# EAGLE design Chessbot_v6 (EAGLE 9.6.2)
AUTHOR: Hudson, Dunn, Ruiz; BOARD_NAME: ChessBotBoard; DOC_NUM: 1; PROJECT_NAME: Chess Bot; REVISION: 6
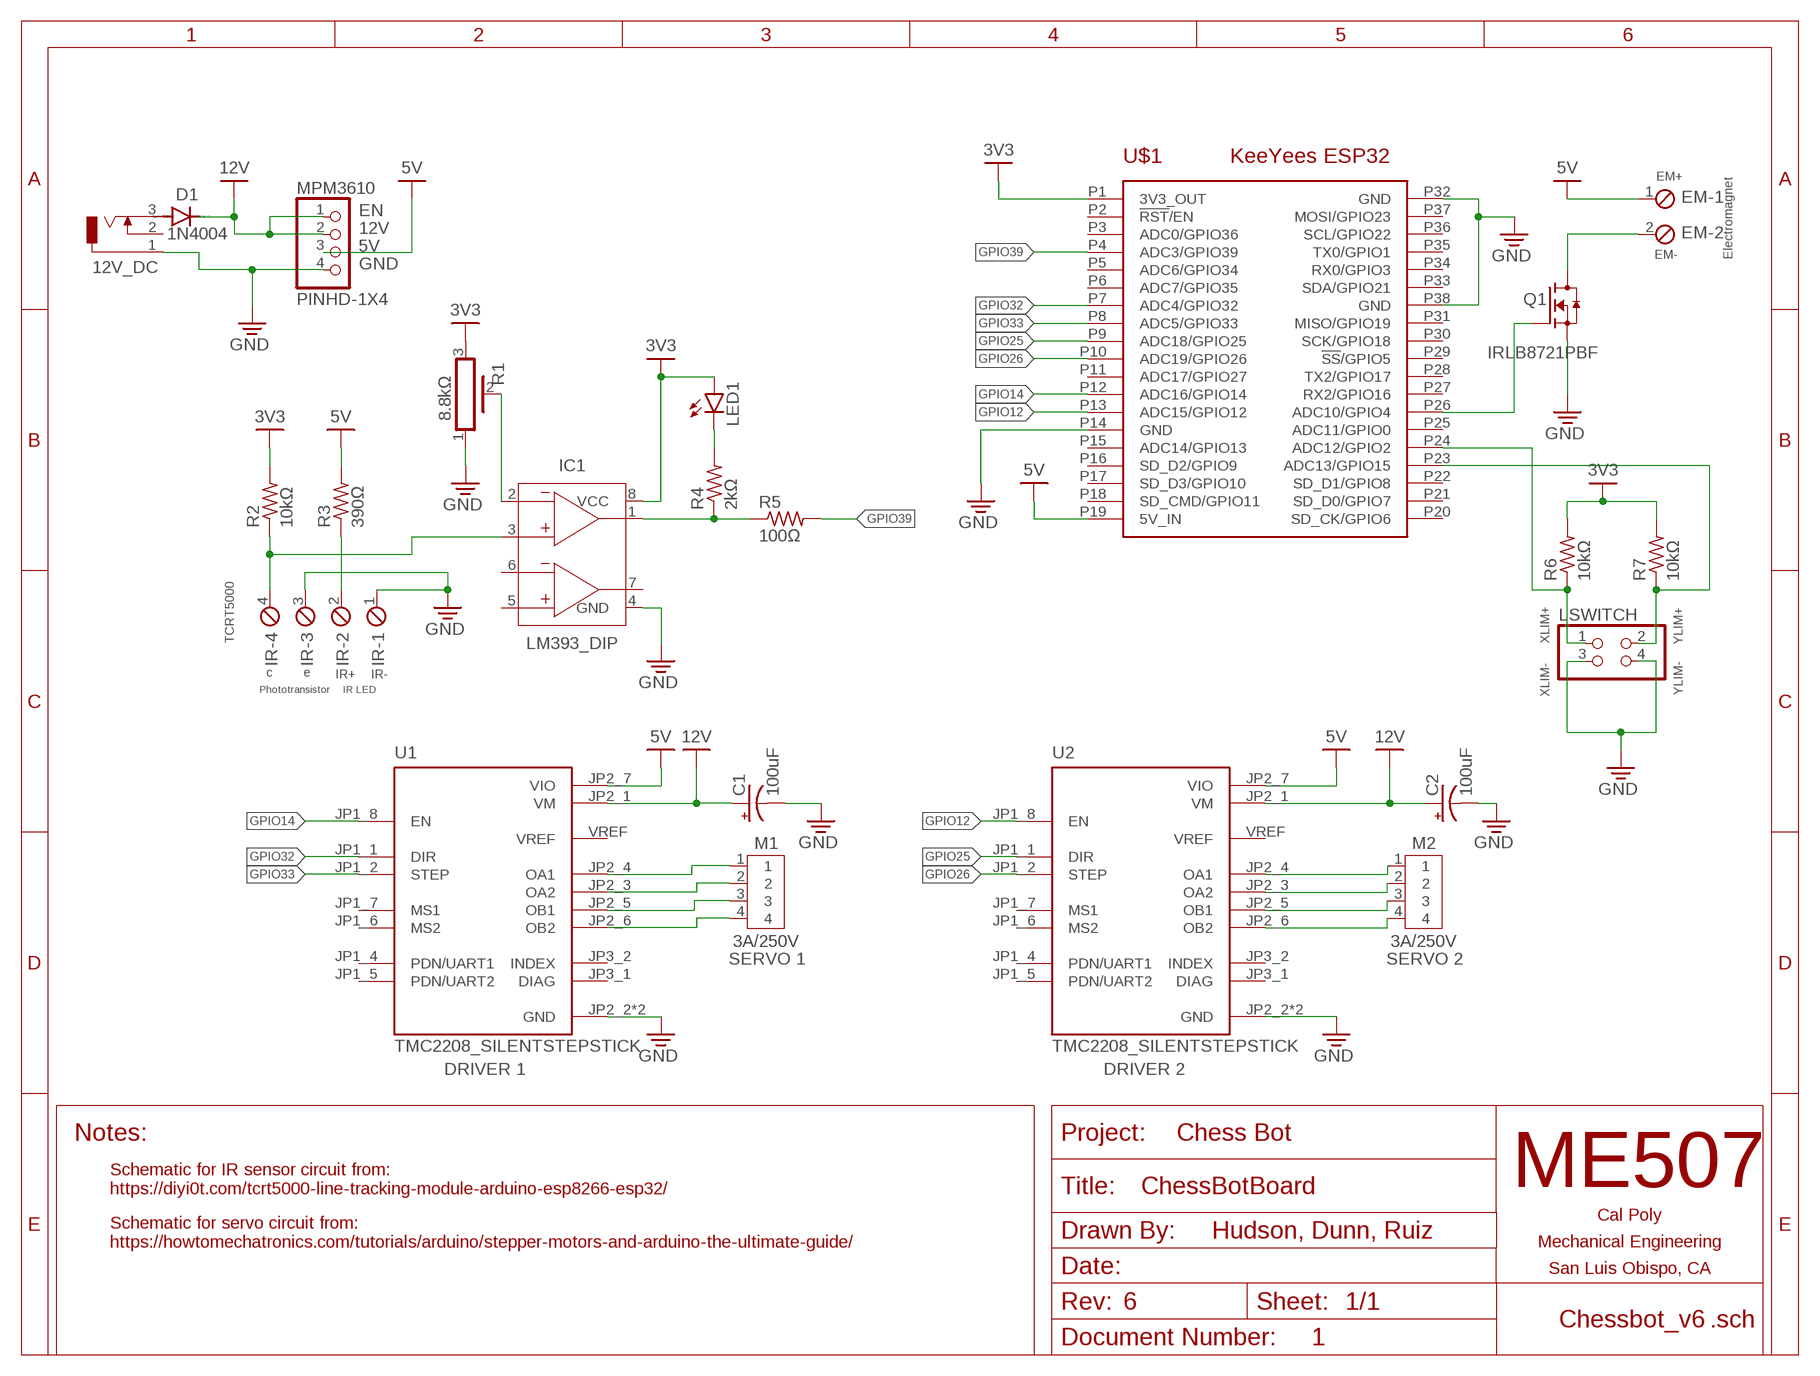
[diagram p0: schematic, sheet 1]

## Parts
12V_DC  DCJ0303  [DCJ0303]
C1  100uF  CPOL-USE2.5-6  [E2,5-6]
C2  100uF  CPOL-USE2.5-6  [E2,5-6]
D1  1N4004  [DO41-10]
EM  SCREWTERM_2P_254  [2POL254]
IC1  LM393_DIP  [DIP826W53P254L959H508Q8B]
IR  SCREWTERM_4P_254  [4POL254]
LED1  LEDSMT1206  [1206]
LSWITCH  PINHD-2X2  [2X02]
M1  3A/250V  B4B-XH-A  [B4B-XH-A]
M2  3A/250V  B4B-XH-A  [B4B-XH-A]
MPM3610  PINHD-1X4  [1X04]
Q1  IRLB8721PBF  [TO254P1067X483X2057-3]
R1  8.8kΩ  PV36Z  [PV36Z]
R2  10kΩ  R-US_R0805  [R0805]
R3  390Ω  R-US_R0805  [R0805]
R4  2kΩ  R-US_R0805  [R0805]
R5  100Ω  R-US_R0805  [R0805]
R6  10kΩ  R-US_R0805  [R0805]
R7  10kΩ  R-US_R0805  [R0805]
U1  TMC2208_SILENTSTEPSTICK  [MODULE_TMC2208_SILENTSTEPSTICK]
U2  TMC2208_SILENTSTEPSTICK  [MODULE_TMC2208_SILENTSTEPSTICK]
U$1  KEEYEES_ESP32EXT  [KEEYEES_ESP32_EXTENDED]

## Nets
3V3: IC1.8(VCC) LED1.A R1.3 R2.2 R6.2 R7.2 U$1.P1(3V3_OUT)
5V: EM.1 MPM3610.3 R3.2 U1.JP2_7(VIO) U2.JP2_7(VIO) U$1.P19(5V_IN)
12V: C1.+ C2.+ D1.C MPM3610.1 MPM3610.2 U1.JP2_1(VM) U2.JP2_1(VM)
GND: 12V_DC.1 C1.- C2.- IC1.4(GND) IR.1 IR.3 LSWITCH.3 LSWITCH.4 MPM3610.4 Q1.3(S) R1.1 U1.JP2_2(GND) U1.JP2_8(GND) U2.JP2_2(GND) U2.JP2_8(GND) U$1.P14(GND) U$1.P32(GND) U$1.P38(GND)
GPIO12: U2.JP1_8(EN) U$1.P13(ADC15/GPIO12)
GPIO14: U1.JP1_8(EN) U$1.P12(ADC16/GPIO14)
GPIO25: U2.JP1_1(DIR) U$1.P9(ADC18/GPIO25)
GPIO26: U2.JP1_2(STEP) U$1.P10(ADC19/GPIO26)
GPIO32: U1.JP1_1(DIR) U$1.P7(ADC4/GPIO32)
GPIO33: U1.JP1_2(STEP) U$1.P8(ADC5/GPIO33)
GPIO39: R5.2 U$1.P4(ADC3/GPIO39)
N$1: M2.1 U2.JP2_4(OA1)
N$2: IC1.2(-IN1) R1.2
N$3: M2.2 U2.JP2_3(OA2)
N$4: IR.2 R3.1
N$5: M2.3 U2.JP2_5(OB1)
N$6: IC1.3(+IN1) IR.4 R2.1
N$7: M2.4 U2.JP2_6(OB2)
N$8: M1.1 U1.JP2_4(OA1)
N$9: EM.2 Q1.2(D)
N$10: M1.2 U1.JP2_3(OA2)
N$11: M1.3 U1.JP2_5(OB1)
N$12: M1.4 U1.JP2_6(OB2)
N$13: IC1.1(OUT1) R4.1 R5.1
N$14: LED1.C R4.2
N$15: 12V_DC.3 D1.A
N$17: Q1.1(G) U$1.P26(ADC10/GPIO4)
N$18: LSWITCH.1 R6.1 U$1.P24(ADC12/GPIO2)
N$22: LSWITCH.2 R7.1 U$1.P23(ADC13/GPIO15)
Unconnected: 12V_DC.2 IC1.5(+IN2) IC1.6(-IN2) IC1.7(OUT2) U1.JP1_4(PDN/UART1) U1.JP1_5(PDN/UART2) U1.JP1_6(MS2) U1.JP1_7(MS1) U1.JP3_1(DIAG) U1.JP3_2(INDEX) U1.VREF U2.JP1_4(PDN/UART1) U2.JP1_5(PDN/UART2) U2.JP1_6(MS2) U2.JP1_7(MS1) U2.JP3_1(DIAG) U2.JP3_2(INDEX) U2.VREF U$1.P2(!RST!/EN) U$1.P3(ADC0/GPIO36) U$1.P5(ADC6/GPIO34) U$1.P6(ADC7/GPIO35) U$1.P11(ADC17/GPIO27) U$1.P15(ADC14/GPIO13) U$1.P16(SD_D2/GPIO9) U$1.P17(SD_D3/GPIO10) U$1.P18(SD_CMD/GPIO11) U$1.P20(SD_CK/GPIO6) U$1.P21(SD_D0/GPIO7) U$1.P22(SD_D1/GPIO8) U$1.P25(ADC11/GPIO0) U$1.P27(RX2/GPIO16) U$1.P28(TX2/GPIO17) U$1.P29(!SS!/GPIO5) U$1.P30(SCK/GPIO18) U$1.P31(MISO/GPIO19) U$1.P33(SDA/GPIO21) U$1.P34(RX0/GPIO3) U$1.P35(TX0/GPIO1) U$1.P36(SCL/GPIO22) U$1.P37(MOSI/GPIO23)

## Notes on the sheet
- EM+
- EN
- 12V
- 5V
- EM- | Electromagnet
- GND
- YLIM+
- TCRT5000 | XLIM+
- c | e | IR+ | IR-
- Phototransistor | IR LED | YLIM-
- XLIM-
- SERVO 1 | SERVO 2
- DRIVER 1 | DRIVER 2
- Schematic for IR sensor circuit from:
  https://diyi0t.com/tcrt5000-line-tracking-module-arduino-esp8266-esp32/
- Schematic for servo circuit from:
  https://howtomechatronics.com/tutorials/arduino/stepper-motors-and-arduino-the-ultimate-guide/

## Library data of the parts
12V_DC = con-jack:DCJ0303: DC POWER JACK Source: DCJ0303.pdf; OC_FARNELL: unknown; OC_NEWARK: unknown
C1 C2 = rcl:CPOL-US: POLARIZED CAPACITOR, American symbol; SPICEPREFIX: C
D1 = diode:1N4004: DIODE general purpose rectifier, 1 A
EM = ME507:SCREWTERM_2P: Screw Terminal Block This part is designed for a screw terminal connector. The 2.54mm (0.100 inch) foorprint can also be used for male or female pin headers such as those on most development boards. One can also solder wires directly into the holes, though this makes modifications or repairs to the system more inconvenient. Larger versions can carry more current.
IC1 = IC_Linear:LM393: Dual Comparators Reference Datasheet <https://www.ti.com/lit/ds/symlink/lm393-n.pdf?ts=1637561071595&ref_url=https%253A%252F%252Fwww.google.com%252F>; CATEGORY: IC_Linear; DESCRIPTION: Differential Dual Comparator; MANUFACTURER: Generic; MPN: Generic; SERIES: LM393; SUB-CATEGORY: Comparator; TYPE: Dual
IR = ME507:SCREWTERM_4P: Screw Terminal Block This part is designed for a screw terminal connector. The 2.54mm (0.100 inch) foorprint can also be used for male or female pin headers such as those on most development boards. One can also solder wires directly into the holes, though this makes modifications or repairs to the system more inconvenient. Larger versions can carry more current.
LED1 = led:LED: LED OSRAM: - CHIPLED LG R971, LG N971, LY N971, LG Q971, LY Q971, LO R971, LY R971 LH N974, LH R974 LS Q976, LO Q976, LY Q976 LO Q996 - Hyper CHIPLED LW Q18S LB Q993, LB Q99A, LB R99A - SideLED LS A670, LO A670, LY A670, LG A670, LP A670 LB A673, LV A673, LT A673, LW A673 LH A674 LY A675 LS A676, LA A676, LO A676, LY A676, LW A676 LS A679, LY A679, LG A679 - Hyper Micro SIDELED® LS Y876, LA Y876, LO Y876, LY Y876 LT Y87S - SmartLED LW L88C, LW L88S LB L89C, LB L89S, LG L890 LS L89K, LO L89K, LY L89K LS L896, LA L896, LO L896, LY L896 - TOPLED LS T670, LO T670, LY T670, LG T670, LP T670 LSG T670, LSP T670, LSY T670, LOP T670, LYG T670 LG T671, LOG T671, LSG T671 LB T673, LV T673, LT T673, LW T673 LH T674 LS T676, LA T676, LO T676, LY T676, LB T676, LH T676, LSB T676, LW T676 LB T67C, LV T67C, LT T67C, LS T67K, LO T67K, LY T67K, LW E67C LS E67B, LA E67B, LO E67B, LY E67B, LB E67C, LV E67C, LT E67C LW T67C LS T679, LY T679, LG T679 LS T770, LO T770, LY T770, LG T770, LP T770 LB T773, LV T773, LT T773, LW T773 LH T774 LS E675, LA E675, LY E675, LS T675 LS T776, LA T776, LO T776, LY T776, LB T776 LHGB T686 LT T68C, LB T68C - Hyper Mini TOPLED® LB M676 - Mini TOPLED Santana® LG M470 LS M47K, LO M47K, LY M47K Source: http://www.osram.convergy.de LUXEON: - LUMILED® LXK2-PW12-R00, LXK2-PW12-S00, LXK2-PW14-U00, LXK2-PW14-V00 LXK2-PM12-R00, LXK2-PM12-S00, LXK2-PM14-U00 LXK2-PE12-Q00, LXK2-PE12-R00, LXK2-PE12-S00, LXK2-PE14-T00, LXK2-PE14-U00 LXK2-PB12-K00, LXK2-PB12-L00, LXK2-PB12-M00, LXK2-PB14-N00, LXK2-PB14-P00, LXK2-PB14-Q00 LXK2-PR12-L00, LXK2-PR12-M00, LXK2-PR14-Q00, LXK2-PR14-R00 LXK2-PD12-Q00, LXK2-PD12-R00, LXK2-PD12-S00 LXK2-PH12-R00, LXK2-PH12-S00 LXK2-PL12-P00, LXK2-PL12-Q00, LXK2-PL12-R00 Source: www.luxeon.com KINGBRIGHT: KA-3528ASYC Source: www.kingbright.com
LSWITCH = pinhead:PINHD-2X2: PIN HEADER
M1 M2 = Connector:B4B-XH-A: XH Connector Top Entry - 4POS Details see: Datasheet <http://www.jst-mfg.com/product/pdf/eng/eXH.pdf>; CATEGORY: CONNECTOR; DSECRIPTION: 2.5mm pitch/disconnctable crimp style connector; MANUFACTURER: JST (XH connector); MPN: B4B-XH-A; OPERATING_TEMPERATURE: -25 C to 85 C; PART_STATUS: ACTIVE; ROHS_COMPLIANT: COMPLAINT; SERIES: B4B-XH-A; SUB_CATEGORY: Through hole; TYPE: TOP ENTRY
MPM3610 = Connector:PINHD-1X4: PIN HEADER; CATEGORY: CONNECTOR; SUB-CATEGORY: PIN-HEADER
Q1 = IRLB8721PBF:IRLB8721PBF: Single N-Channel 30 V 8.7 mOhm 13 nC HEXFET® Power Mosfet - TO-220-3 Check availability <https://pricing.snapeda.com/parts/IRLB8721PBF/Infineon%20Technologies/view-part?ref=eda>; AVAILABILITY: In Stock; DESCRIPTION: Very Low RDS(on) at 4.5V VGS | Ultra-Low Gate Impedance | Fully Characterized Avalanche Voltage and Current | Lead-Free; MF: Infineon Technologies; MP: IRLB8721PBF; PACKAGE: TO-220-3 Infineon; PRICE: None; PURCHASE-URL: https://pricing.snapeda.com/search/part/IRLB8721PBF/?ref=eda
R1 = Resistor:PV36: Rectangular Trimmer Potentiometers - PV36 Series Datasheet <https://www.bourns.com/docs/Product-Datasheets/pv36.pdf>; CATEGORY: Resistor; DESCRIPTION: Lead Sealed Type Multiturn PV36 Series; MANUFACTURER: BOURNS; MPN: PV36Z; OPERATING_TEMPERATURE: -55 to +125 °C; PART_STATUS: Active; ROHS_COMPLIANCE: RoHS Compliant; SERIES: PV36; SUB-CATEGORY: Trimpot; TYPE: Lead Sealed
R2-R7 = rcl:R-US_: RESISTOR, American symbol; SPICEPREFIX: R
U1 U2 = TMC2208_SILENTSTEPSTICK:TMC2208_SILENTSTEPSTICK: TMC2208 Motor Controller/Driver, Stepper Power Management Evaluation Board Check availability <https://pricing.snapeda.com/parts/TMC2208%20SILENTSTEPSTICK/Trinamic%20Motion/view-part?ref=eda>; AVAILABILITY: In Stock; DESCRIPTION: TMC2208 Motor Controller/Driver, Stepper Power Management Evaluation Board; MF: Trinamic Motion; MP: TMC2208 SILENTSTEPSTICK; PACKAGE: None; PRICE: None; PURCHASE-URL: https://pricing.snapeda.com/search/part/TMC2208 SILENTSTEPSTICK/?ref=eda
U$1 = ME507:KEEYEES_ESP32: Footprint for an add-on board (shield, hat, etc.) for a KeeYees ESP32 development board with ESP-WROOM-32 module. 38 pins.

## Board
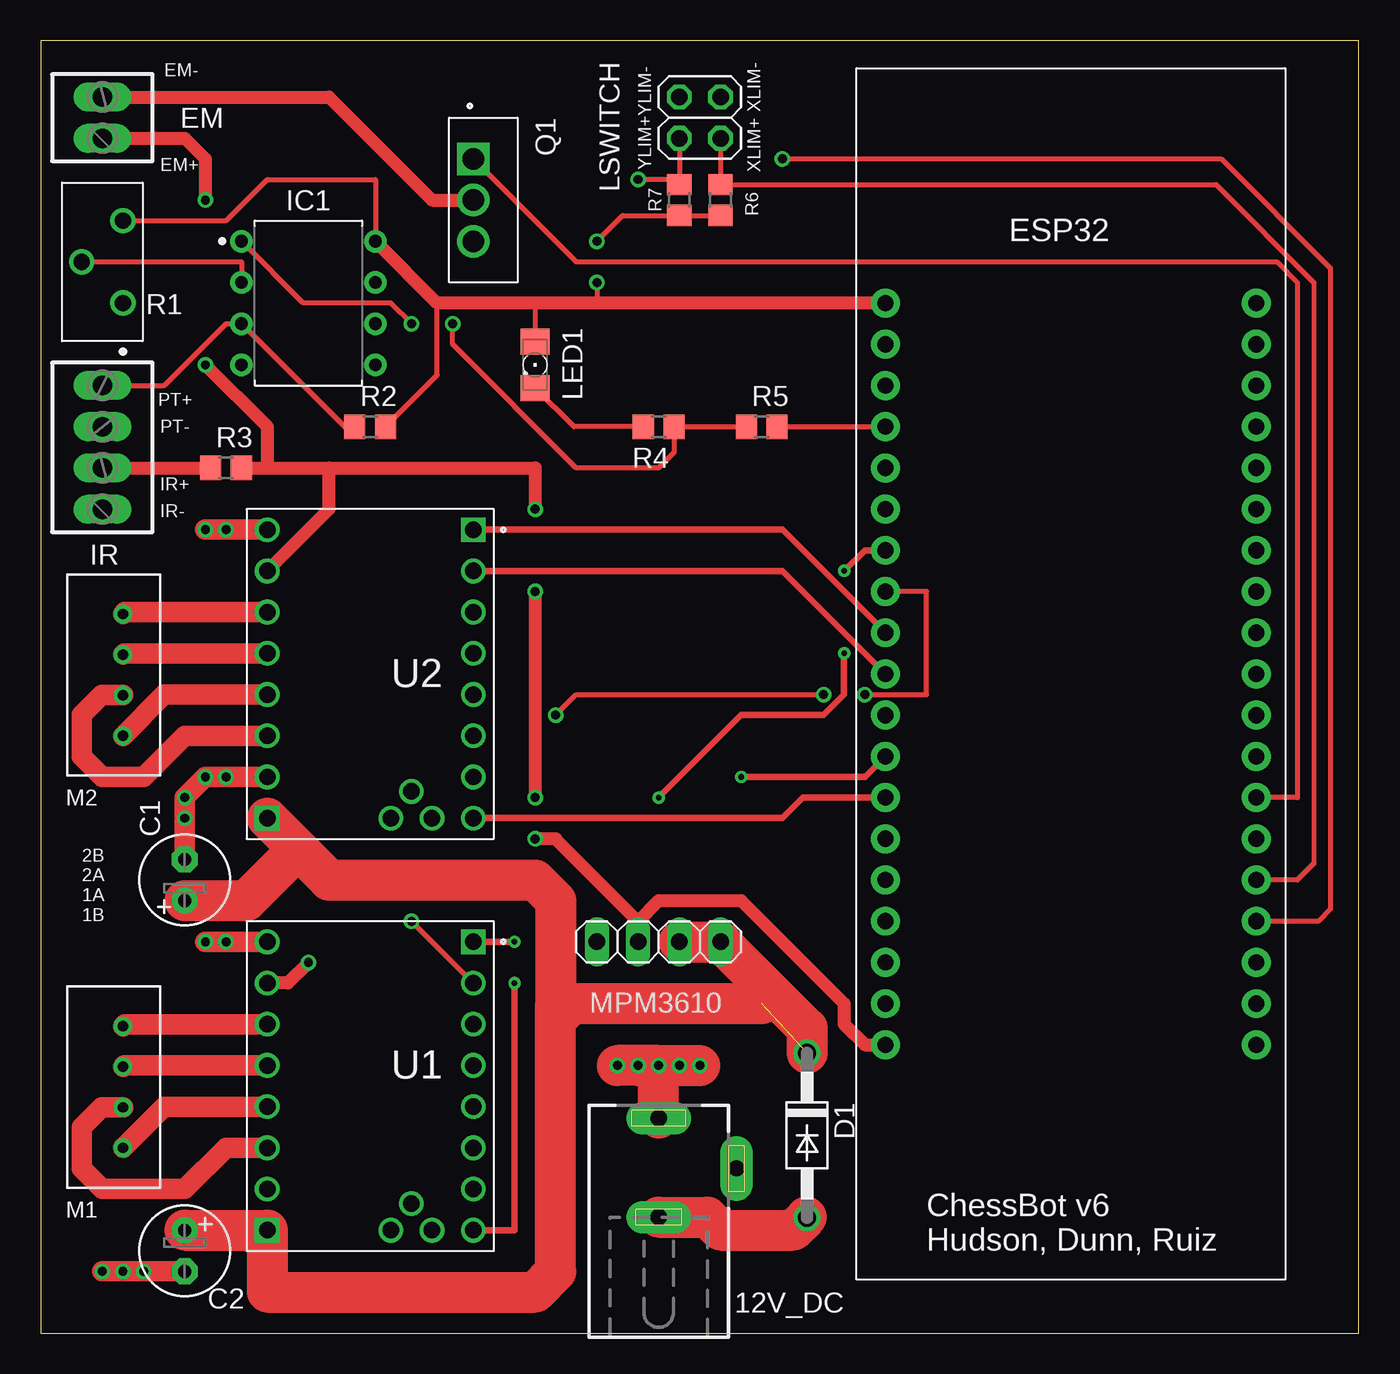
[diagram p1: board, top side]
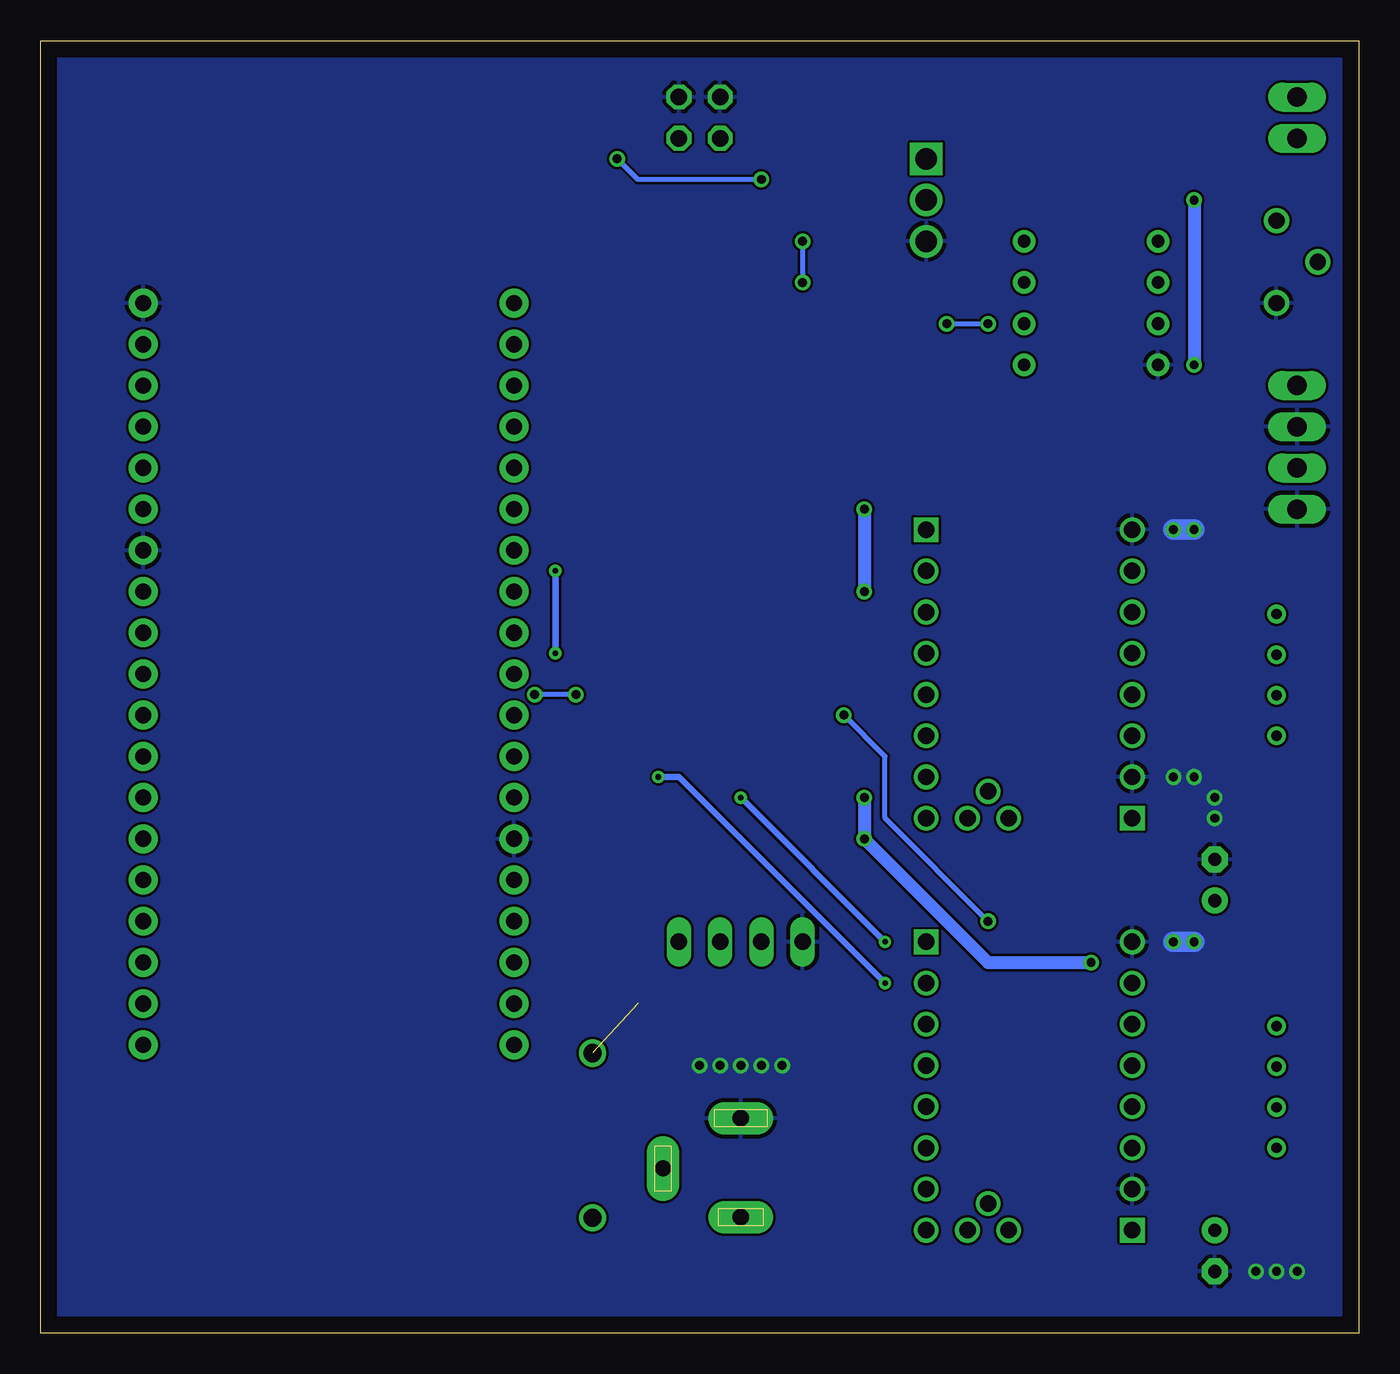
[diagram p2: board, bottom side, seen from below]

Size 81.26 x 79.68 mm. Coordinates in mm from the lower left corner, seen from the top.
Outline: 0,0 81.26,0 81.26,79.68 0,79.68 0,0
Copper layers (1*16): Top 0.035mm / dielectric 1.5mm / Bottom 0.035mm
Design rules "default": minimum track width 6mil, minimum drill 0.35mm, track to track 6mil, track to pad 6mil, pad to pad 6mil, via to via 6mil, smd to smd 6mil, copper to edge 40mil, drill to drill 6mil, minimum pad ring 10mil, minimum via ring 8mil, stop-mask expansion 4mil, vias tented up to drill 0mil, thermal gap 10mil

### Footprints (pad centres in the part's own frame; a part is rotated, then mirrored left to right if it is on the bottom)
DCJ0303 = drill 1 pad 2 long: 1 0,3.1; 2 4.8,0; 3 0,-3
E2,5-6 = drill 0.813 pad 1.6: + -1.27,0 | drill 0.813 pad 1.6 octagon: - 1.27,0
DO41-10 = drill 1.118: A 5.08,0; C -5.08,0
2POL254 = drill 1.2 long: 1 -1.27,0; 2 1.27,0
DIP826W53P254L959H508Q8B = drill 0.786 pad 1.386: 1 -4.13,3.81; 2 -4.13,1.27; 3 -4.13,-1.27; 4 -4.13,-3.81; 5 4.13,-3.81; 6 4.13,-1.27; 7 4.13,1.27; 8 4.13,3.81
4POL254 = drill 1.2 long: 1 -3.81,0; 2 -1.27,0; 3 1.27,0; 4 3.81,0
1206 = smd 1.6 x 1.803: A -1.422,0; C 1.422,0
2X02 = drill 1.016 octagon: 1 -1.27,-1.27; 2 -1.27,1.27; 3 1.27,-1.27; 4 1.27,1.27
B4B-XH-A = drill 0.64: 1 0,0; 2 2.5,0; 3 5,0; 4 7.5,0
1X04 = drill 1.016 long: 1 -3.81,0; 2 -1.27,0; 3 1.27,0; 4 3.81,0
TO254P1067X483X2057-3 = drill 1.33 pad 2 square: 1 -2.54,0 | drill 1.33 pad 2: 2 0,0; 3 2.54,0
PV36Z = drill 1 pad 1.564: 1 0,0; 2 2.54,2.54; 3 5.08,0
R0805 = smd 1.3 x 1.5: 1 -0.95,0; 2 0.95,0
MODULE_TMC2208_SILENTSTEPSTICK = drill 1.016 square: JP1_1 6.35,8.89; JP2_1 -6.35,-8.89 | drill 1.016: JP1_2 6.35,6.35; JP1_3 6.35,3.81; JP1_4 6.35,1.27; JP1_5 6.35,-1.27; JP1_6 6.35,-3.81; JP1_7 6.35,-6.35; JP1_8 6.35,-8.89; JP2_2 -6.35,-6.35; JP2_3 -6.35,-3.81; JP2_4 -6.35,-1.27; JP2_5 -6.35,1.27; JP2_6 -6.35,3.81; JP2_7 -6.35,6.35; JP2_8 -6.35,8.89; JP3_1 1.27,-8.89; JP3_2 3.81,-8.89; VREF 2.54,-7.239
KEEYEES_ESP32_EXTENDED = drill 1 pad 1.778: P1 -11.43,21.59; P2 -11.43,19.05; P3 -11.43,16.51; P4 -11.43,13.97; P5 -11.43,11.43; P6 -11.43,8.89; P7 -11.43,6.35; P8 -11.43,3.81; P9 -11.43,1.27; P10 -11.43,-1.27; P11 -11.43,-3.81; P12 -11.43,-6.35; P13 -11.43,-8.89; P14 -11.43,-11.43; P15 -11.43,-13.97; P16 -11.43,-16.51; P17 -11.43,-19.05; P18 -11.43,-21.59; P19 -11.43,-24.13; P20 11.43,-24.13; P21 11.43,-21.59; P22 11.43,-19.05; P23 11.43,-16.51; P24 11.43,-13.97; P25 11.43,-11.43; P26 11.43,-8.89; P27 11.43,-6.35; P28 11.43,-3.81; P29 11.43,-1.27; P30 11.43,1.27; P31 11.43,3.81; P32 11.43,6.35; P33 11.43,8.89; P34 11.43,11.43; P35 11.43,13.97; P36 11.43,16.51; P37 11.43,19.05; P38 11.43,21.59

### Placement (x,y rotation side)
12V_DC  38.1,10.16 0 top
C1  8.89,27.94 90 top
C2  8.89,5.08 270 top
D1  47.24,12.19 270 top
EM  3.81,74.93 90 top
IC1  16.51,63.5 0 top
IR  3.81,54.61 90 top
LED1  30.48,59.69 270 top
LSWITCH  40.64,74.93 90 top
M1  5.08,11.43 90 top
M2  5.08,36.83 90 top
MPM3610  38.1,24.13 180 top
Q1  26.67,69.85 270 top
R1  5.08,63.5 90 top
R2  20.32,55.88 0 top
R3  11.43,53.34 0 top
R4  38.1,55.88 180 top
R5  44.45,55.88 0 top
R6  41.91,69.85 270 top
R7  39.37,69.85 270 top
U1  20.32,15.24 0 top
U2  20.32,40.64 0 top
U$1  63.5,41.91 0 top

### Tracks (layer width: path | path; a pad name or v marks a point on that pad's centre or on a via)
3V3  (via drill 0.55)
  Top 0.305: R1.3 11.43,68.58 13.97,71.12 20.64,71.12 IC1.8 | R2.2 24.45,59.06 24.45,63.5 | 30.48,63.5 LED1.A | 34.69,67.71 v34.29,67.31 35.88,68.9 R7.2 R6.2 | v34.29,64.77 34.29,63.5
  Top 0.813: IC1.8 24.45,63.5 30.48,63.5 34.29,63.5 U$1.P1
  Bottom 0.305: v34.29,67.31 v34.29,64.77
5V  (via drill 0.55)
  Top 0.813: 36.83,25.4 38.1,26.67 43.18,26.67 49.53,20.32 49.53,19.05 50.8,17.78 U$1.P19 | MPM3610.3 36.83,25.4 | 36.83,25.4 31.75,30.48 v30.48,30.48 | v16.51,22.86 15.24,21.59 U1.JP2_7 | R3.2 13.97,53.34 | 13.97,53.34 17.78,53.34 | 17.78,53.34 30.48,53.34 v30.48,50.8 | v30.48,45.72 v30.48,33.02 | U2.JP2_7 17.78,50.8 17.78,53.34 | EM.1 8.89,73.66 10.16,72.39 v10.16,69.85 | v10.16,59.69 13.97,55.88 13.97,53.34
  Bottom 0.813: v16.51,22.86 22.86,22.86 v30.48,30.48 v30.48,33.02 | v30.48,50.8 v30.48,45.72 | v10.16,69.85 v10.16,59.69
12V  (1 unrouted)
  Top 2.54: 31.75,20.32 31.75,3.81 30.48,2.54 13.97,2.54 U1.JP2_1 C2.+ | U2.JP2_1 15.88,29.84 | 15.88,29.84 17.78,27.94 30.48,27.94 31.75,26.67 31.75,20.32 | 15.88,29.84 12.7,26.67 C1.+ | MPM3610.2 MPM3610.1 47.24,18.8 D1.C | 31.75,20.32 32.26,19.81 | 31.75,20.32 44.45,20.32
GND  (via drill 0.55)
  Top 1.27: U2.JP2_2 v11.43,34.29 v10.16,34.29 v8.89,33.02 v8.89,31.75 C1.- | C2.- v6.35,3.81 v5.08,3.81 v3.81,3.81 | U2.JP2_8 v11.43,49.53 v10.16,49.53 | U1.JP2_8 v11.43,24.13 v10.16,24.13
  Top 2.54: 12V_DC.1 v38.1,16.51 | v38.1,16.51 v36.83,16.51 v35.56,16.51 | v38.1,16.51 v39.37,16.51 v40.64,16.51
  Bottom 1.27: v11.43,49.53 v10.16,49.53 | v11.43,24.13 v10.16,24.13
  pour Bottom: 0,80.01 81.28,80.01 81.28,0 0,0
GPIO12
  Top 0.406: U2.JP1_8 45.72,31.75 46.99,33.02 U$1.P13
GPIO14  (via drill 0.35)
  Top 0.406: U1.JP1_8 29.21,6.35 v29.21,21.59 | U$1.P12 50.8,34.29 v43.18,34.29
  Bottom 0.406: v29.21,21.59 41.91,34.29 v43.18,34.29
GPIO25
  Top 0.406: U2.JP1_1 45.72,49.53 U$1.P9
GPIO26
  Top 0.406: U2.JP1_2 45.72,46.99 U$1.P10
GPIO32  (via drill 0.35)
  Top 0.406: U1.JP1_1 v29.21,24.13 | v38.1,33.02 43.18,38.1 48.26,38.1 49.53,39.37 v49.53,41.91 | v49.53,46.99 50.8,48.26 U$1.P7
  Bottom 0.406: v29.21,24.13 v38.1,33.02 | v49.53,41.91 v49.53,46.99
GPIO33  (via drill 0.55)
  Top 0.305: U1.JP1_2 v22.86,25.4 | v31.75,38.1 33.02,39.37 v48.26,39.37 | v50.8,39.37 54.61,39.37 54.61,45.72 U$1.P8
  Bottom 0.305: v22.86,25.4 29.21,31.75 29.21,35.56 v31.75,38.1 | v48.26,39.37 v50.8,39.37
GPIO39
  Top 0.305: R5.2 U$1.P4
N$1
  Top 1.27: M2.1 7.62,39.37 U2.JP2_4
N$2
  Top 0.305: R1.2 12.38,66.04 IC1.2
N$3
  Top 1.27: M2.2 3.77,39.33 2.54,38.1 2.54,35.56 3.81,34.29 6.35,34.29 8.89,36.83 U2.JP2_3
N$4
  Top 0.813: IR.2 R3.1
N$5
  Top 1.27: M2.3 5.16,41.91 U2.JP2_5
N$6
  Top 0.305: IR.4 7.62,58.42 11.43,62.23 IC1.3 18.73,55.88 R2.1
N$7
  Top 1.27: M2.4 5.2,44.45 U2.JP2_6
N$8
  Top 1.27: M1.1 7.62,13.97 U1.JP2_4
N$9
  Top 0.813: EM.2 17.78,76.2 24.13,69.85 Q1.2
N$10
  Top 1.27: M1.2 3.77,13.93 2.54,12.7 2.54,10.16 3.81,8.89 8.89,8.89 11.43,11.43 U1.JP2_3
N$11
  Top 1.27: M1.3 5.16,16.51 U1.JP2_5
N$12
  Top 1.27: M1.4 5.2,19.05 U1.JP2_6
N$13  (via drill 0.55)
  Top 0.305: R5.1 R4.1 39.05,54.29 38.1,53.34 33.02,53.34 25.4,60.96 v25.4,62.23 | v22.86,62.23 21.59,63.5 16.19,63.5 IC1.1
  Bottom 0.305: v25.4,62.23 24.13,62.23 v22.86,62.23
N$14
  Top 0.305: LED1.C 32.87,55.88 R4.2
N$15
  Top 1.27: 47.2,7.16 D1.A
  Top 2.54: 12V_DC.3 41.1,7.16 41.91,6.35 46.39,6.35 47.2,7.16
N$17
  Top 0.305: Q1.1 33.02,66.04 76.2,66.04 77.47,64.77 77.47,33.02 U$1.P26
N$18
  Top 0.305: LSWITCH.1 R6.1 72.46,70.8 78.49,64.77 78.49,28.96 77.47,27.94 U$1.P24
N$22  (via drill 0.55)
  Top 0.305: LSWITCH.2 R7.1 39.05,71.12 v36.83,71.12 | v45.72,72.39 72.77,72.39 79.5,65.66 79.5,26.16 78.74,25.4 U$1.P23
  Bottom 0.305: v36.83,71.12 44.45,71.12 v45.72,72.39

### Text on the board
tNames: YLIM- | XLIM- | EM- | YLIM+ | XLIM+ | EM+ | ESP32 | PT+ | PT- | IR+ | IR- | 2B / 2A / 1A / 1B | ChessBot v6 / Hudson, Dunn, Ruiz